# EAGLE schematic emonDCduo-ESP v4.0 (EAGLE 9.2.1)
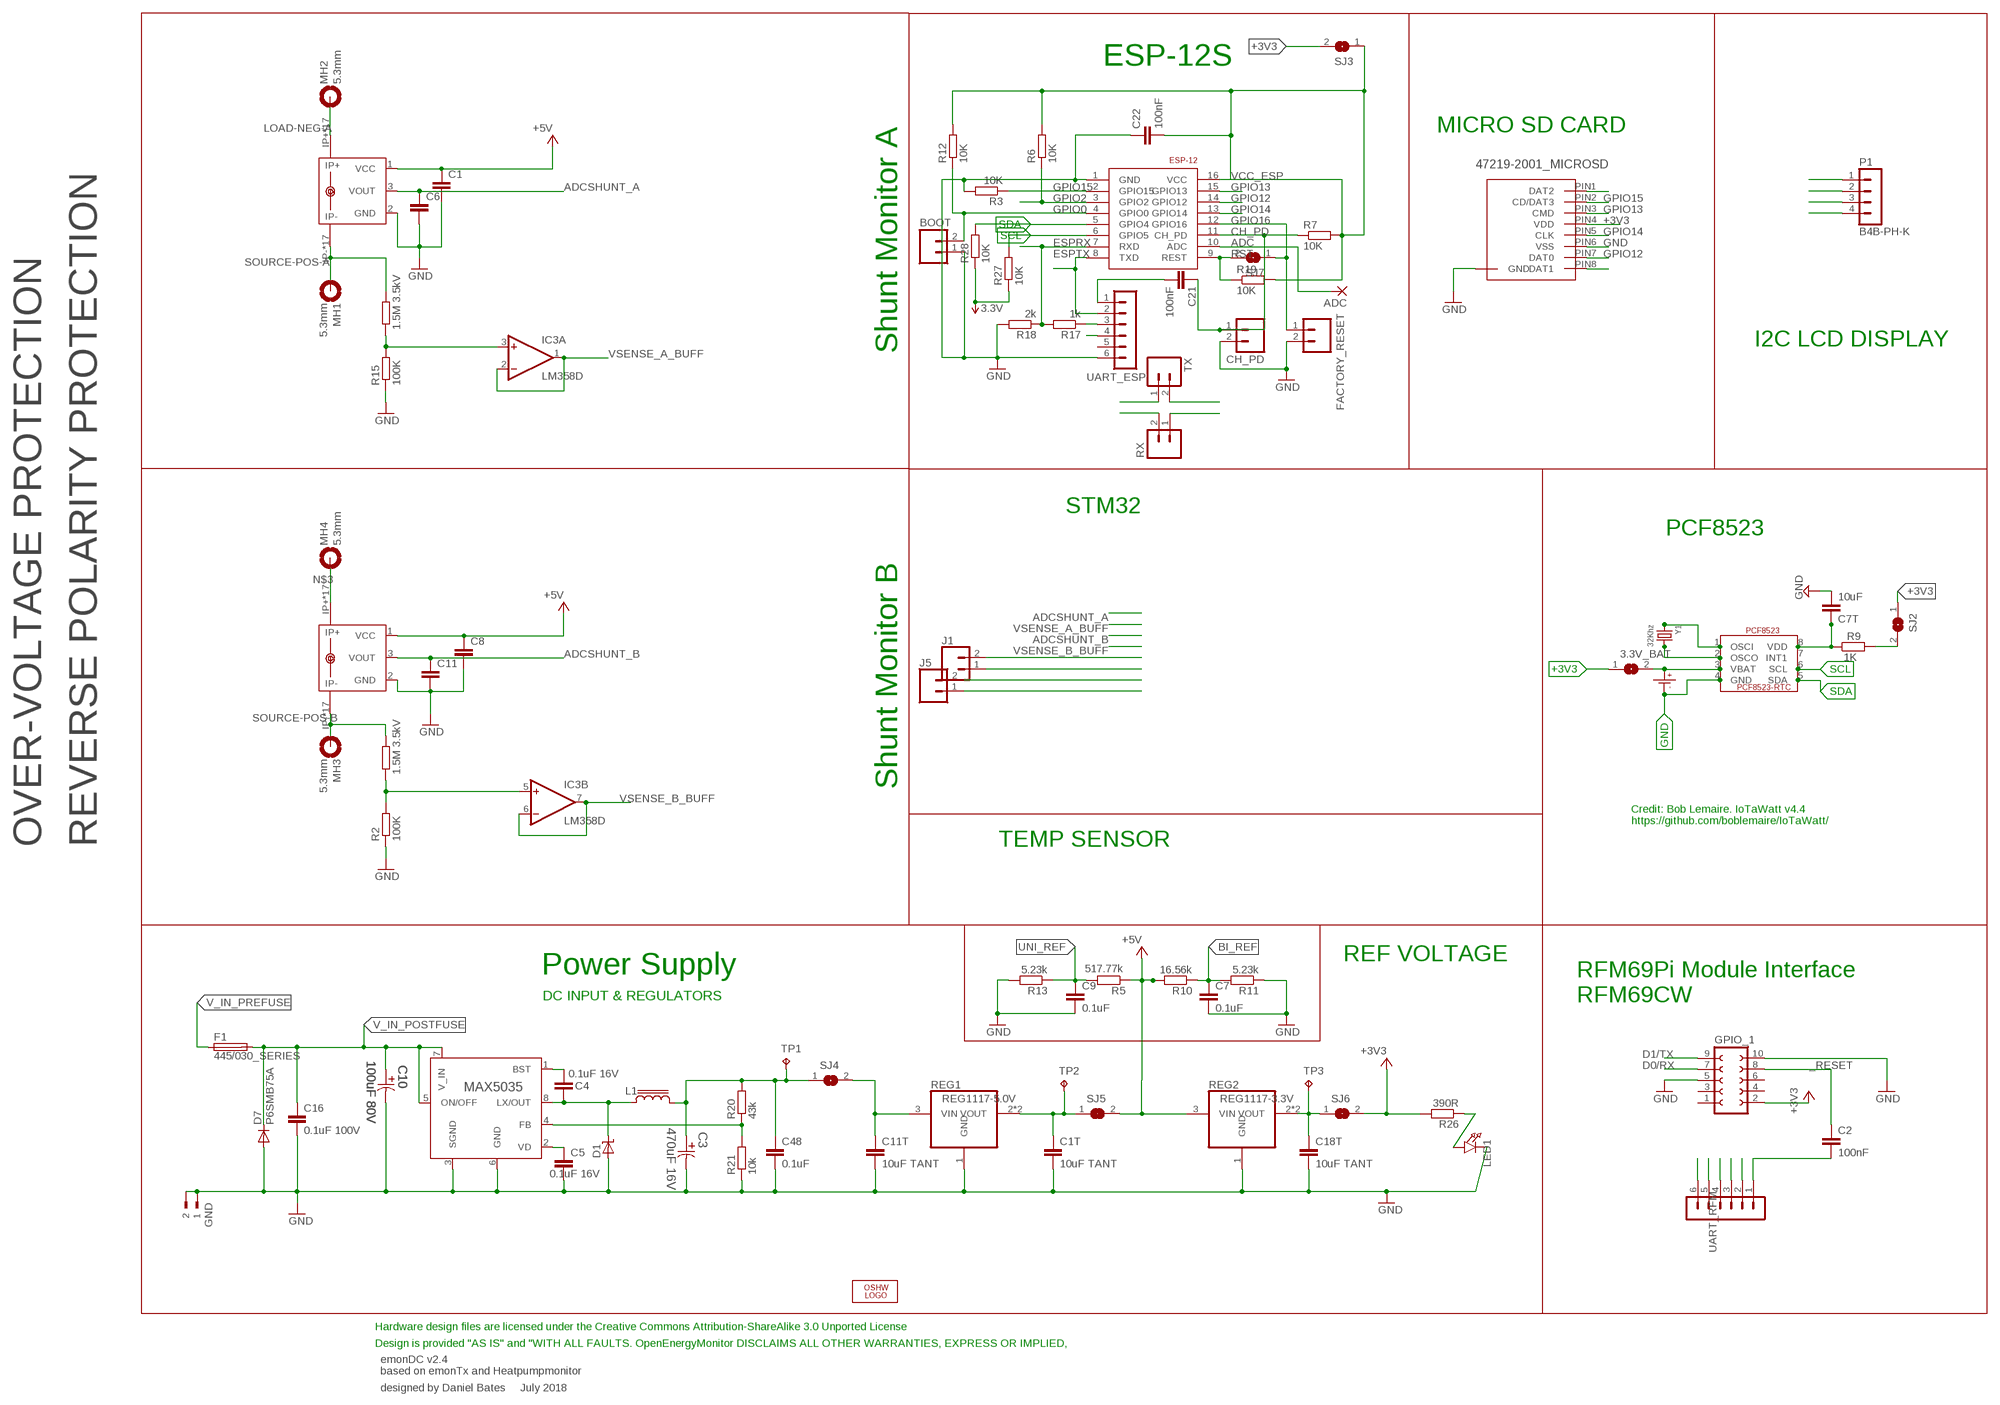
[diagram p0: schematic, sheet 1]

## Parts
3.3V_BAT  SJ-CONCON  [SJ-CON]
ADC  2,15/1,0  [2,15/1,0]
BOOT  M02PTH  [1X02]
C1  0.1uF 100V  C-EUC0603  [C0603]
C1T  10uF TANT  C-EUC0603  [C0603]
C2  100nF  C-EUC0603  [C0603]
C3  470uF 16V  EEE-FK1C471P-CASE-F  [CAPAE830X1050N]
C4  0.1uF 16V  C-EUC0603  [C0603]
C5  0.1uF 16V  C-EUC0603  [C0603]
C6  0.1uF 100V  C-EUC0603  [C0603]
C7  0.1uF  C-EUC0603  [C0603]
C7T  10uF  C-EUC0603  [C0603]
C8  0.1uF 100V  C-EUC0603  [C0603]
C9  0.1uF  C-EUC0603  [C0603]
C10  100uF 80V  EEV-FK1K101Q-CASE-H13  [CAPAE1350X1400N]
C11  0.1uF 100V  C-EUC0603  [C0603]
C11T  10uF TANT  C-EUC0603  [C0603]
C16  0.1uF 100V  C-EUC0603  [C0603]
C18T  10uF TANT  C-EUC0603  [C0603]
C21  100nF  C-EUC0603  [C0603]
C22  100nF  C-EUC0603  [C0603]
C48  0.1uF  C-EUC0603  [C0603]
CH_PD  M02PTH  [1X02]
CR1220  CR1220SMD  [CR1220SMD]
D1  MBRS1100T3G  [SMB_1]
D7  P6SMB75A  DIODE-DO214AA  [DO214AA]
ESP-12  ESP8266_ESP-12  [ESP8266-ESP12]
F1  445/030_SERIES  [445/030_SERIES_LITTELFUSE]
GND  180-2  [180-2]
GPIO_1  FE05-2_RFM69PI_OUTLINERFM69PI  [FE05-2_RFM69PI_OULTINE]
IC1  ACS758LCB-050B-PFF-T  [CB-PFF]
IC2  ACS758LCB-050B-PFF-T  [CB-PFF]
IC3  LM358D  [SO08]
IO16  FACTORY_RESET  M02PTH  [1X02]
J1  CONN_02  [1X02]
J5  CONN_02  [1X02]
L1  SRR1208  [SSR1208]
LED1  LED1206  [CHIPLED_1206]
LOGO1  OSHW_LOGO_6MILX0200-NT  [OSHW_6X200_NOTEXT]
MH1  5.3mm  MOUNT-PAD-ROUND5.3  [5,3//11-PAD]
MH2  5.3mm  MOUNT-PAD-ROUND5.3  [5,3//11-PAD]
MH3  5.3mm  MOUNT-PAD-ROUND5.3  [5,3//11-PAD]
MH4  5.3mm  MOUNT-PAD-ROUND5.3  [5,3//11-PAD]
MICRO_SD  47219-2001_MICROSD  [47219-2001_MICROSD]
P1  B4B-PH-K  [B4B-PH-K]
PCF8523  PCF8523_RTC  [SOIC_8]
R1  1.5M 3.5kV  R-EU_0411/15  [0411/15]
R2  100K  R-EU_R0603  [R0603]
R3  10K  R-EU_R0603  [R0603]
R5  517.77k  R-EU_R0603  [R0603]
R6  10K  R-EU_R0603  [R0603]
R7  10K  R-EU_R0603  [R0603]
R9  1K  R-EU_R0603  [R0603]
R10  16.56k  R-EU_0204/7  [0204/7]
R11  5.23k  R-EU_0204/7  [0204/7]
R12  10K  R-EU_R0603  [R0603]
R13  5.23k  R-EU_R0603  [R0603]
R14  1.5M 3.5kV  R-EU_0411/15  [0411/15]
R15  100K  R-EU_R0603  [R0603]
R17  1k  R-EU_R0603  [R0603]
R18  2k  R-EU_R0603  [R0603]
R19  10K  R-EU_R0603  [R0603]
R20  43k  R-EU_R0603  [R0603]
R21  10k  R-EU_R0603  [R0603]
R26  390R  R-EU_R0603  [R0603]
R27  10K  R-EU_R0603  [R0603]
R28  10K  R-EU_R0603  [R0603]
REG0  MAX5035  [21-0111D_SBE-14]
REG1  REG1117-5.0V  REG1117  [SOT223]
REG2  REG1117-3.3V  REG1117  [SOT223]
RX  M02PTH  [1X02]
SJ2  SJ-CONCON  [SJ-CON]
SJ3  SJ-CONCON  [SJ-CON]
SJ4  SJ-CONCON  [SJ-CON]
SJ5  SJ-CONCON  [SJ-CON]
SJ6  SJ-CONCON  [SJ-CON]
SJ7  SJ  [SJ]
TP1  TPPAD1-13  [P1-13]
TP2  TPPAD1-13  [P1-13]
TP3  TPPAD1-13  [P1-13]
TX  M02PTH  [1X02]
UART_ESP  UART_ESP  MA06-1  [MA06-1]
UART_RFM  UART_RFM  MA06-1  [MA06-1]
Y1  32Khz  CRYSTAL8X3.8SMT  [CRYSTAL_8X3.8]

## Nets
3.3V_PRE [thin_power]: C18T.1 REG2.2(VOUT) REG2.4(VOUT) SJ6.1 TP3.TP
5V_PRE [thin_power]: C1T.1 REG1.2(VOUT) REG1.4(VOUT) SJ5.1 TP2.TP
6.5V [thin_power]: C11T.1 REG1.3(VIN) SJ4.2
+3V3 [thin_power]: 3.3V_BAT.1 GPIO_1.2 MICRO_SD.PIN4(VDD) P1.3 R26.2 R27.1 R28.1 SJ2.1 SJ3.2 SJ6.2 ; supply symbol labelled 3.3V
+5V [thin_power]: C1.1 C8.1 IC1.1(VCC) IC2.1(VCC) R5.1 R10.2 REG2.3(VIN) SJ5.2 UART_ESP.4 UART_RFM.4
_RESET: C2.1 GPIO_1.8
ADC: ADC.1(P) ESP-12.10(ADC)
ADCSHUNT_A: C6.1 IC1.3(VOUT)
ADCSHUNT_B: C11.1 IC2.3(VOUT)
BI_REF: C7.1 R10.1 R11.2
BST [thin_power]: C4.1 REG0.1(BST)
CH6: J5.2
CH7: J5.1
CH_PD: C21.1 CH_PD.1 ESP-12.11(CH_PD) R7.1
D0/RX: GPIO_1.7 TX.2 UART_RFM.2
D1/TX: GPIO_1.9 RX.1 UART_RFM.3
ESPRX: ESP-12.7(RXD) R17.2 R18.1 RX.2
ESPTX: ESP-12.8(TXD) TX.1 UART_ESP.2
GND: BOOT.1 C1.2 C1T.2 C3.2 C5.2 C6.2 C7.2 C7T.2 C8.2 C9.2 C10.2 C11.2 C11T.2 C16.2 C18T.2 C22.1 C48.2 CH_PD.2 CR1220.P-(P$-) D1.A D7.A ESP-12.1(GND) GND.1 GND.2 GPIO_1.5 GPIO_1.10 IC1.2(GND) IC2.2(GND) IO16.2 LED1.C MICRO_SD.P$1(GND) MICRO_SD.P$2(GND) MICRO_SD.P$3(GND) MICRO_SD.P$4(GND) MICRO_SD.PIN6(VSS) P1.4 PCF8523.4(GND) R2.1 R3.2 R11.1 R13.2 R15.1 R18.2 R21.1 REG0.3(SGND) REG0.6(GND) REG1.1(GND) REG2.1(GND) UART_ESP.6 UART_RFM.6
GPIO0: BOOT.2 ESP-12.4(GPIO0) R12.1
GPIO2: ESP-12.3(GPIO2) R6.1
GPIO12: ESP-12.14(GPIO12) MICRO_SD.PIN7(DAT0)
GPIO13: ESP-12.15(GPIO13) MICRO_SD.PIN3(CMD)
GPIO14: ESP-12.13(GPIO14) MICRO_SD.PIN5(CLK)
GPIO15: ESP-12.2(GPIO15) MICRO_SD.PIN2(CD/DAT3) R3.1
GPIO16: ESP-12.12(GPIO16) IO16.1 SJ7.1
LOAD-NEG-A [power]: IC1.IP+ IC1.IP+@2(IP+) IC1.IP+@3(IP+) IC1.IP+@4(IP+) IC1.IP+@5(IP+) IC1.IP+@6(IP+) IC1.IP+@7(IP+) IC1.IP+@8(IP+) IC1.IP+@9(IP+) IC1.IP+@10(IP+) IC1.IP+@11(IP+) IC1.IP+@12(IP+) IC1.IP+@13(IP+) IC1.IP+@14(IP+) IC1.IP+@15(IP+) IC1.IP+@16(IP+) IC1.IP+@17(IP+) MH2.B5,5(MOUNT)
LX [thin_power]: C4.2 D1.C L1.1 REG0.8(LX/OUT)
N$1: R20.1 R21.2 REG0.4(FB)
N$3 [power]: IC2.IP+ IC2.IP+@2(IP+) IC2.IP+@3(IP+) IC2.IP+@4(IP+) IC2.IP+@5(IP+) IC2.IP+@6(IP+) IC2.IP+@7(IP+) IC2.IP+@8(IP+) IC2.IP+@9(IP+) IC2.IP+@10(IP+) IC2.IP+@11(IP+) IC2.IP+@12(IP+) IC2.IP+@13(IP+) IC2.IP+@14(IP+) IC2.IP+@15(IP+) IC2.IP+@16(IP+) IC2.IP+@17(IP+) MH4.B5,5(MOUNT)
N$4: J1.2
N$5: LED1.A R26.1
N$6: J1.1
N$7: MICRO_SD.PIN1(DAT2)
N$9: IC3.5(B:+IN) R1.1 R2.2
N$10: C7T.1 PCF8523.8(VDD) R9.1
N$20: UART_RFM.5
N$24: R9.2 SJ2.2
N$30: C21.2 UART_ESP.1
N$32: MICRO_SD.PIN8(DAT1)
N$36: R17.1 UART_ESP.3
N$44: PCF8523.2(OSCO) Y1.P$4
N$45: PCF8523.1(OSCI) Y1.P$1
N$301: C2.2 UART_RFM.1
PRE_6.5V [thin_power]: C3.1 C48.1 L1.2 R20.2 SJ4.1 TP1.TP
RST: ESP-12.9(REST) R19.1 SJ7.2
SCL: ESP-12.6(GPIO5) P1.2 PCF8523.6(SCL) R27.2
SDA: ESP-12.5(GPIO4) P1.1 PCF8523.5(SDA) R28.2
SOURCE-POS-A [power]: IC1.IP- IC1.IP-@2(IP-) IC1.IP-@3(IP-) IC1.IP-@4(IP-) IC1.IP-@5(IP-) IC1.IP-@6(IP-) IC1.IP-@7(IP-) IC1.IP-@8(IP-) IC1.IP-@9(IP-) IC1.IP-@10(IP-) IC1.IP-@11(IP-) IC1.IP-@12(IP-) IC1.IP-@13(IP-) IC1.IP-@14(IP-) IC1.IP-@15(IP-) IC1.IP-@16(IP-) IC1.IP-@17(IP-) MH1.B5,5(MOUNT) R14.2
SOURCE-POS-B [power]: IC2.IP- IC2.IP-@2(IP-) IC2.IP-@3(IP-) IC2.IP-@4(IP-) IC2.IP-@5(IP-) IC2.IP-@6(IP-) IC2.IP-@7(IP-) IC2.IP-@8(IP-) IC2.IP-@9(IP-) IC2.IP-@10(IP-) IC2.IP-@11(IP-) IC2.IP-@12(IP-) IC2.IP-@13(IP-) IC2.IP-@14(IP-) IC2.IP-@15(IP-) IC2.IP-@16(IP-) IC2.IP-@17(IP-) MH3.B5,5(MOUNT) R1.2
UNI_REF: C9.1 R5.2 R13.1
V_IN_POSTFUSE [power]: C10.1 C16.1 D7.C F1.P$3 F1.P$4 REG0.5(ON/OFF) REG0.7(V_IN)
V_IN_PREFUSE [power]: F1.P$1 F1.P$2
VBAT: 3.3V_BAT.2 CR1220.P+(P$+) PCF8523.3(VBAT)
VCC_ESP: C22.2 ESP-12.16(VCC) R6.2 R7.2 R12.2 R19.2 SJ3.1
VD [thin_power]: C5.1 REG0.2(VD)
VSENSE_A: IC3.3(A:+IN) R14.1 R15.2
VSENSE_A_BUFF: IC3.1(A:OUT) IC3.2(A:-IN)
VSENSE_B_BUFF: IC3.6(B:-IN) IC3.7(B:OUT)
Unconnected: GPIO_1.1 GPIO_1.3 GPIO_1.4 GPIO_1.6 PCF8523.7(INT1) UART_ESP.5

## Notes on the sheet
- ESP-12S
- MICRO SD CARD
- I2C LCD DISPLAY
- Shunt Monitor A
- STM32
- PCF8523
- Shunt Monitor B
- Credit: Bob Lemaire. IoTaWatt v4.4
  https://github.com/boblemaire/IoTaWatt/
- OVER-VOLTAGE PROTECTION | REVERSE POLARITY PROTECTION | TEMP SENSOR
- REF VOLTAGE
- Power Supply
- DC INPUT & REGULATORS
- RFM69Pi Module Interface
  RFM69CW
- Hardware design files are licensed under the Creative Commons Attribution-ShareAlike 3.0 Unported License
- Design is provided "AS IS" and "WITH ALL FAULTS. OpenEnergyMonitor DISCLAIMS ALL OTHER WARRANTIES, EXPRESS OR IMPLIED,
- emonDC v2.4
  based on emonTx and Heatpumpmonitor
- designed by Daniel Bates     July 2018

## Power pins joined to a net without a drawn wire
V+: IC3.8(P:V+)
V-: IC3.4(P:V-)

## Library data of the parts
3.3V_BAT SJ4 = jumper-con:SJ-CON: SMD solder JUMPER
ADC = wirepad:2,15/1,0: THROUGH-HOLE PAD
BOOT CH_PD IO16 RX TX = SparkFun:M02: Header 2 Standard 2-pin 0.1" header. Use with straight break away headers (SKU : PRT-00116), right angle break away headers (PRT-00553), swiss pins (PRT-00743), machine pins (PRT-00117), and female headers (PRT-00115). Molex polarized connector foot print use with SKU : PRT-08233 with associated crimp pins and housings.
C1 C6 C8 C11 = rcl:C-EU: CAPACITOR, European symbol; MPN: C1608X7S2A104K080AB
C1T C2 C4 C5 C7 C9 C11T C16 C18T C21 C22 C48 = rcl:C-EU: CAPACITOR, European symbol
C3 = Panasonic-EEEFK_EEEFP:EEE-: Aluminum Electrolytic Capacitors,Surface Mount Type; MPN: EEE-FK1C471P; OC_FARNELL: 9695710; OC_NEWARK: 96K9385; PACKAGE: CASE-F; SUPPLIER: PANASONIC; TOLERANCE: ±20 %; VALUE: 470UF; VOLTAGERATING: 16V
C7T = rcl@1:C-EU: CAPACITOR, European symbol
C10 = Panasonic-EEE-EEV-EEF-ECQ:EEV-: Aluminum Electrolytic Capacitors,Surface Mount Type; MPN: EEVFK1K101Q; OC_FARNELL: 9696113; OC_NEWARK: 96K9484; SUPPLIER: PANASONIC; TOLERANCE: ±20 %; VALUE: 100UF; VOLTAGERATING: 80V
CR1220 = IotaWatt_parts:CR1220SMD: CR1220 Battery SMD; MPN: Harwin S8411-45R
D1 = diodes:MBRS1100T3G: MBRS1100T3G 100V 1A Freewheeling Diode; MPN: MBRS1100T3G
D7 = diode:DIODE-: DIODE
ESP-12 = ESP8266-ESP12:ESP8266_ESP-12
F1 = LITTELFUSE 455:030 SERIES:445/030_SERIES: MPN 04450001N
GND = con-weidmueller-sl35_db:180-2: WEIDMUELLER CLAMP CONNECTOR; OC_FARNELL: unknown; OC_NEWARK: unknown
GPIO_1 = con-lsta-RFM69Pi:FE05-2_RFM69PI_OUTLINE: FEMALE HEADER
IC1 IC2 = allegro:ACS758*: Thermally Enhanced, Fully Integrated, Hall Effect-Based Linear Current Sensor with 100 micro Ohm Current Conductor display layer 49 Reference in BRD and place VIAs on circles Source: http://www.allegromicro.com/en/Products/Part_Numbers/0758/0758.pdf; MPN: ACS758LCB-050B-PFF-T; OC_FARNELL: 1718997; OC_NEWARK: 04R7131
IC3 = linear:LM358: OP AMP also LM158; LM258; LM2904 Source: http://cache.national.com/ds/LM/LM158.pdf
J1 J5 = SparkFun-Connectors:CONN_02: Multi connection point. Often used as Generic Header-pin footprint for 0.1 inch spaced/style header connections On any of the 0.1 inch spaced packages, you can populate with these: Break Away Headers - Straight <https://www.sparkfun.com/products/116> (PRT-00116) Break Away Male Headers - Right Angle <https://www.sparkfun.com/products/553> (PRT-00553) Female Headers <https://www.sparkfun.com/products/115> (PRT-00115) Break Away Headers - Machine Pin <https://www.sparkfun.com/products/117> (PRT-00117) Break Away Female Headers - Swiss Machine Pin <https://www.sparkfun.com/products/743> (PRT-00743) For SCREWTERMINALS and SPRING TERMINALS visit here: Screw Terimnals on SparkFun.com <https://www.sparkfun.com/search/results?term=Screw+Terminals> (5mm/3.5mm/2.54mm spacing) This device is also useful as a general connection point to wire up your design to another part of your project. Our various solder wires solder well into these plated through hole pads. Hook-Up Wire - Assortment (Stranded, 22 AWG) <https://www.sparkfun.com/products/11375> (PRT-11375) Hook-Up Wire - Assortment (Solid Core, 22 AWG) <https://www.sparkfun.com/products/11367> (PRT-11367) View the entire wire category on our website here <https://www.sparkfun.com/categories/141> Special notes: Molex polarized connector foot print use with: PRT-08233 with associated crimp pins and housings. 2.54_SCREWTERM for use with PRT-10571. 3.5mm Screw Terminal footprints for PRT-08084 5mm Screw Terminal footprints for use with PRT-08432
L1 = inductor-bourns:SRR1208: POWER INDUCTOR; MPN: SRR1208-151YL
LED1 = microbuilder:LED: LED 0603 - 0603 Surface Mount Package 2mA: Green LED - Low Power (3.9mcd, 2ma, 1.7Vf) - Digikey: 475-2709-2-ND Orange LED - Low Power (9.8mcd, 2ma, 1.8Vf) - Digikey: 475-1194-2-ND Red LED - Low Power (5mcd, 2ma, 1.8Vf) - Digikey: 475-1195-2-ND Yellow LED - Low Power (7mcd, 2ma, 1.8Vf) - Digikey: 475-1196-2-ND 5mA: Blue LED - Low Power (17mcd, 5ma, 2.9Vf) - Digikey: LNJ937W8CRACT-ND 0805 - 0805 Surface Mount Package 2mA: Red LED (8.8mcd, 2mA, 1.8Vf, Clear) - Low Power [Digikey: 475-2510-1-ND] Green LED (5mcd, 2mA, 1.8Vf, Clear) - Low Power [Digikey: 475-2730-1-ND] Yellow LED (11.3mcd, 2mA, 1.8Vf, Clear) - Low Power [Digikey: 475-2555-1-ND] 20mA: Red LED (104mcd, 20mA, Diffused) - LS R976 [Digikey: 475-1278-6-ND] Red LED (12mcd, 20mA, 2.0Vf, Clear) - APT2012EC [Digikey: 754-1128-1-ND] Green LED (15mcd, 20mA, 2.2Vf, Clear) - APT2012GC [Digikey: 754-1131-1-ND] Orange LED (160mcd, 20mA, 2.1Vf, Clear) - APT2012SECK [Digikey: 754-1130-1-ND] 1206 - 1206 Surface Mount Package Green LED (26mcd, 20mA, Diffused) - LG N971 [Digikey: 475-1407-6-ND] Red LED (15mcd, 20mA, Diffused) - LH N974 [Digikey: 475-1416-6-ND]
LOGO1 = ohw-logo:OSHW_LOGO_6MIL; OC_FARNELL: unknown
MH1-MH4 = holes-db:MOUNT-PAD-ROUND: MOUNTING PAD, round
MICRO_SD = MOLEX 47219-2001:47219-2001_MICROSD
P1 = JST-PH:B4B-PH-K: HEADER
PCF8523 = emonDC parts:PCF8523_RTC: PCF8523-RTC SOIC-8
R1 R14 = rcl7:R-EU_: RESISTOR, European symbol; MPN: MCWR06X1003FTL
R2 R15 = rcl:R-EU_: RESISTOR, European symbol; MPN: MCWR06X5901FTL
R3 R6 R7 R12 R17-R19 R27 R28 = rcl:R-EU_: RESISTOR, European symbol
R5 R13 = rcl7:R-EU_: RESISTOR, European symbol
R9 R20 R21 = rcl@1:R-EU_: RESISTOR, European symbol
R10 R11 R26 = rcl:R-EU_: RESISTOR, European symbol; SPICEPREFIX: R
REG0 = MAX5035:MAX5035: SWITCHING REGULATOR 5.0V 1.0A; MPN: MAX5035EASA+
REG1 = burr-brown-db:REG1117: 800mA and 1A Low Dropout (LDO) Positive Regulator 1.8V, 2.5V, 2.85V, 3.3V, 5V, and Adj; MF: TEXAS INSTRUMENTS; MPN: REG1117-5.0; OC_FARNELL: 1097566; OC_NEWARK: 14P6981
REG2 = burr-brown-db:REG1117: 800mA and 1A Low Dropout (LDO) Positive Regulator 1.8V, 2.5V, 2.85V, 3.3V, 5V, and Adj; MF: TEXAS INSTRUMENTS; MPN: REG1117-3.3; OC_FARNELL: 1097566; OC_NEWARK: 14P6981
SJ2 SJ3 SJ5 SJ6 = jumper-con_db:SJ-CON: SMD solder JUMPER
SJ7 = jumper:SJ: SMD solder JUMPER
TP1-TP3 = testpad:TP: Test pad
UART_ESP UART_RFM = JeeLabs:MA06-1: PIN HEADER
Y1 = microbuilder:CRYSTAL: Crystals HC49UP - Surface Mount Crystal 4.0MHz 18pF +/-30ppm Surface Mount Crystal [Digikey: 535-9857-1-ND] 12.0 MHz Surface Mount Crystal [Digikey: 535-9869-6-ND] 25.0 MHz Surface Mount Crystal [Digikey: 535-9078-1-ND] 2.5 x 2.0mm - MEMs SMT Crystal 16.0 MHz 10pF 20ppm 2.5 x 2.0mm Crystal [Digikey -40-85°C: 535-10923-1-ND] 3.2 x 2.5mm - MEMs SMT Crystal 12.0 MHz 8pF 15ppm 3.2 x 2.5mm Crystal [Digikey: -10-70°C: 644-1047-1-ND -40-125°C: 644-1128-1-ND] 16.0 MHz 8pF 15ppm 3.2 x 2.5mm Crystal [Digikey: -10-70°C: 644-1049-1-ND -40-125°C: 644-1129-2-ND] 16.0 MHz 10pF 10ppm 3.2 x 2.5mm Crystal [Digikey: 644-1100-1-ND] 27.12 MHz 18pF 30ppm 3.2 x 2.5mm Crystal [Digikey: 887-1424-1-ND] 27.12MHz 10pF 10ppm 3.2 x 2.5mm Crystal [Digikey: 887-1329-1-ND] 4.9 x 1.8mm - MEMs SMT Crystal 32.768 KHz 12.5pF 20ppm 4.9 x 1.8mm Crystal [Digikey: SE2415CT-ND] 8.0 x 3.8mm - Surface Mount Crystal 32.768kHz 12.5pF 20ppm -40°C-85°C [Digikey: 535-9166-2-ND] Cylinder 32.768KHz Cylinder Crystal (2x6mm body) [Ex. Digikey: 300-8341-2-ND]

## Net classes
0 default: clearance 0.203 mm
1 power: width 0.61 mm, clearance 0.61 mm
2 thin_power: width 0.406 mm, clearance 0.305 mm